# Altium schematic sheet Power.SchDoc
size A4; SheetNumber: 5; SheetTotal: 5
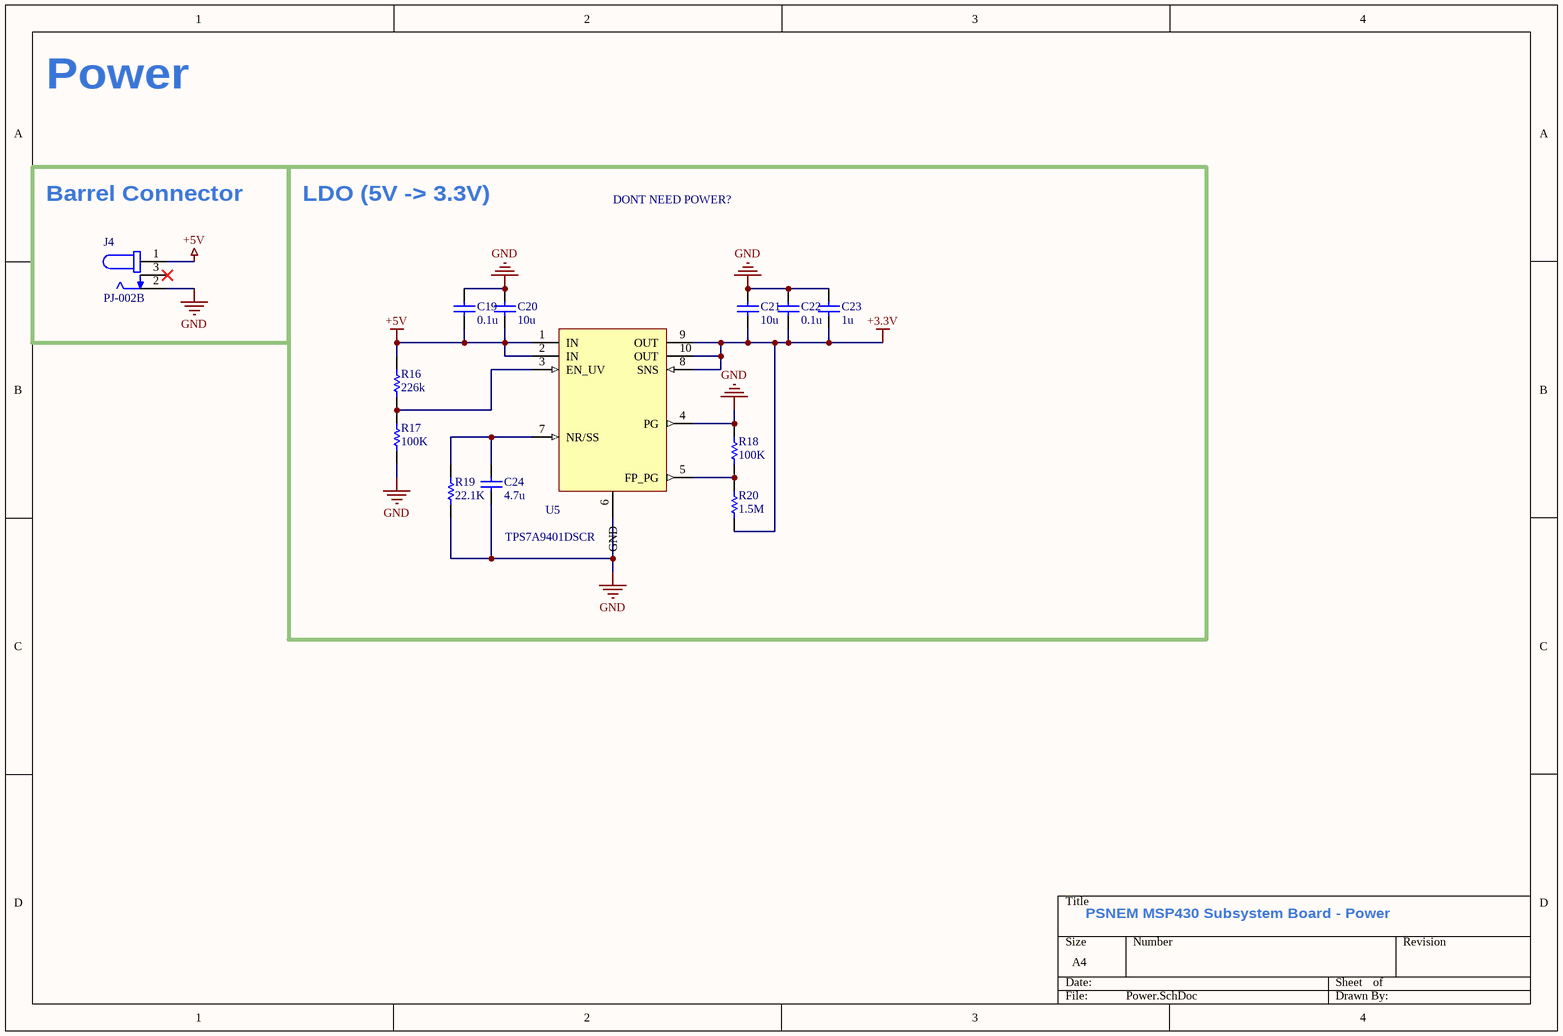
[diagram p0: Power.SchDoc]

## Parts
C19  0.1u  [0805 Cap]
C20  10u  [0805 Cap]
C21  10u  [0805 Cap]
C22  0.1u  [0805 Cap]
C23  1u  [0805 Cap]
C24  4.7u  [0805 Cap]
J4  PJ-002B  [PJ-002B]
R16  226k  [RESC1608X06N]
R17  100K  [RESC1608X06N]
R18  100K  [RESC1608X06N]
R19  22.1K  [RESC1608X06N]
R20  1.5M  [RESC1608X06N]
U5  TPS7A9401DSCR  [TPS7A9401DSCR]

## Blocks framed on the sheet
Barrel Connector: J4
LDO (5V -> 3.3V): C19-C24 R16-R20 U5

## Nets
+3.3V: C21.1 C22.1 C23.2 R20.1 U5.8(SNS) U5.9(OUT) U5.10(OUT)
+5V: C19.2 C20.1 J4.1 R16.2 U5.1(IN) U5.2(IN)
GND: C19.1 C20.2 C21.2 C22.2 C23.1 C24.1 J4.2 R17.1 R18.2 R19.1 U5.4(PG)
NetC24_2: C24.2 R19.2 U5.7(NR/SS)
NetR16_1: R16.1 R17.2 U5.3(EN_UV)
NetR18_1: R18.1 R20.2 U5.5(FP_PG)

Not connected (* = marked no-connect by the designer): J4 3*; U5 6(GND)

## Notes on the sheet
- Power
- DONT NEED POWER?
- PSNEM MSP430 Subsystem Board - Power

## Library data of the parts
C19 C22 = CC0805KRX7R9BB104: 0.1 µF ±10% 50V Ceramic Capacitor X7R 0805 (2012 Metric); value: 0.1u
C20 C21 = CL21B106KPQNNNE: 10 µF ±10% 10V Ceramic Capacitor X7R 0805 (2012 Metric); value: 10u
C23 = CC0805KKX7R7BB105: 1 µF ±10% 16V Ceramic Capacitor X7R 0805 (2012 Metric); value: 1u
C24 = CL21B475KOFNFNE: 4.7 µF ±10% 16V Ceramic Capacitor X7R 0805 (2012 Metric); value: 4.7u
J4 = PJ-002B: Power Barrel Connector Jack 2.50mm ID (0.098"), 5.50mm OD (0.217") Through Hole, Right Angle
R16 = RN73H1JTTD2263B25: Thin Film Resistors - SMD 226kOhm,0603,0.1%,25; value: 226k
R17 R18 = ERA-3VRW1003V: Thin Film Resistors - SMD 0603 0.05% 100Kohm 10ppm SMD; value: 100K
R19 = TNPW060322K1BEEA: Thin Film Resistors - SMD 22.1Kohms .1% 25ppm; value: 22.1K
R20 = MCT0603MD1504BP500: Thin Film Resistors - SMD .125W 1.5Mohms .1% 0603 25ppm; value: 1.5M
U5 = TPS7A9401DSCR: Linear Voltage Regulator IC Positive Adjustable 1 Output 1A 10-WSON (3x3); Manufacturer: Texas Instruments; Manufacturer PN: TPS7A9401DSCR